# Altium project LM-003.PrjPcb
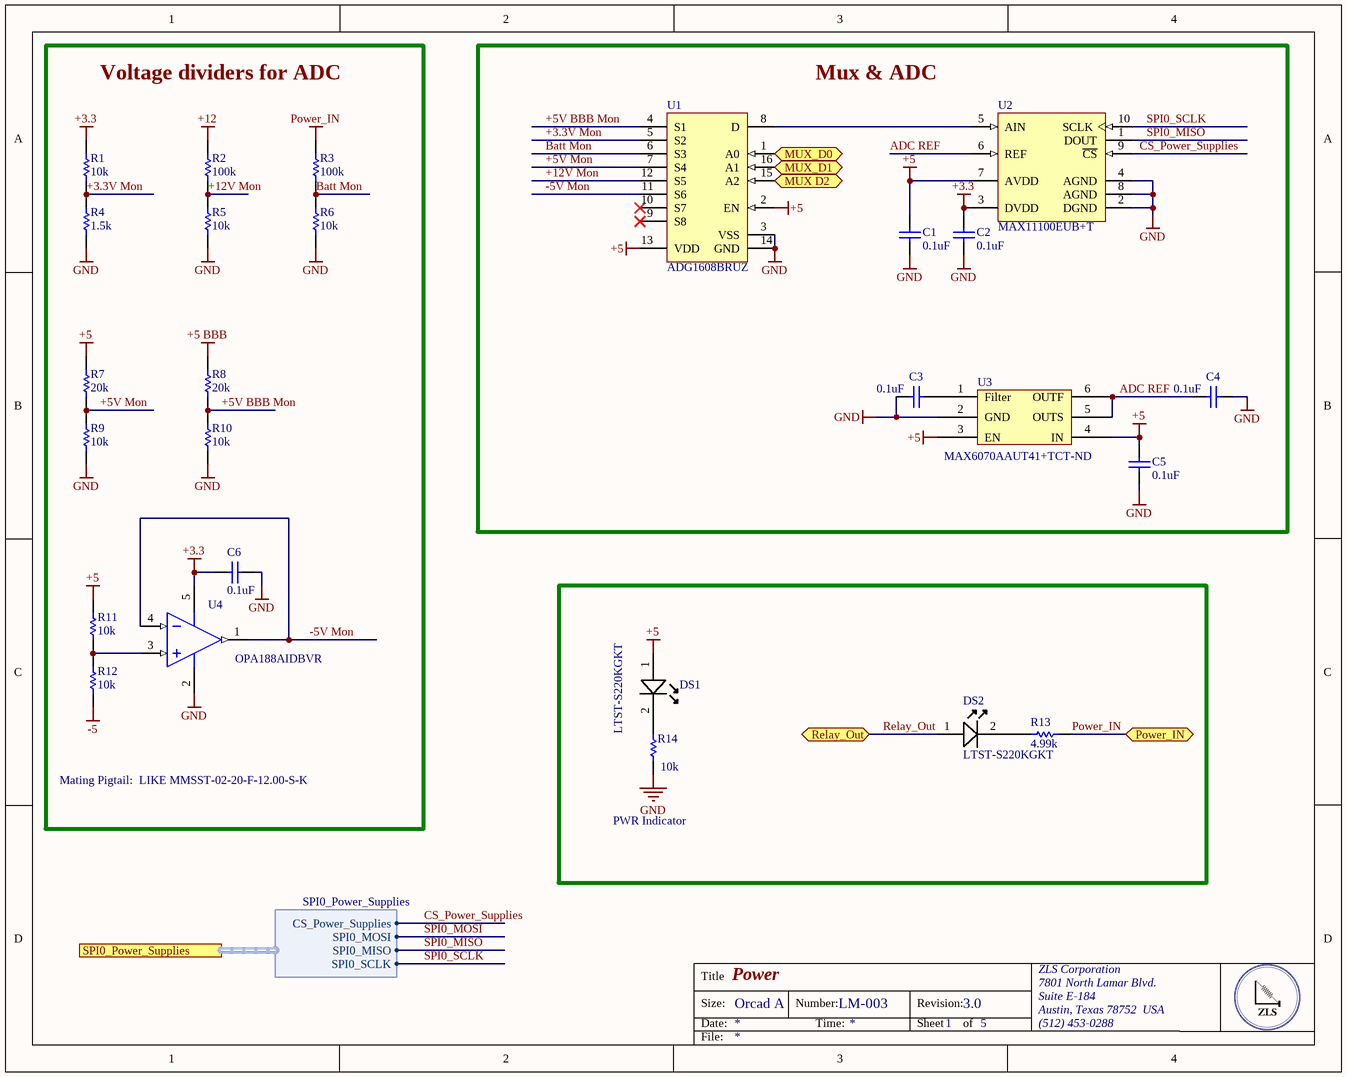
[diagram p0: Power.SchDoc]
5 sheets, 66 parts. Net scope: flat (ports and power ports of the same name join across sheets).
Board file: LM-003.PcbDoc
Sheets:
  Power.SchDoc
  BBB Headers.SchDoc
  Connectors.SchDoc
  RS232.SchDoc
  heater_control.SchDoc

## Sheet Power.SchDoc: Power
size OrCAD A; DocumentNumber: LM-003; Revision: 3.0; SheetNumber: 1; SheetTotal: 5

### Parts
(Parts that share a designator on the sheet are numbered #1, #2 ... from top to bottom, then left to right.)
C1  0.1uF  [CAPC0402(1005)60_L]
C2  0.1uF  [CAPC0402(1005)60_L]
C3  0.1uF  [CAPC0402(1005)60_L]
C4  0.1uF  [CAPC0402(1005)60_L]
C5  0.1uF  [CAPC0402(1005)60_L]
C6  0.1uF  [CAPC0402(1005)60_L]
DS1  Manufacturer Part Number: LTST-S220KGKT  [0805C_L]  (hidden comment: Lite-On LTST-S220KGKT Green LED, 571 nm 2012 (0805) Side View, Rectangle Lens SMD package)
DS2  Manufacturer Part Number: LTST-S220KGKT  [0805C_L]  (hidden comment: Lite-On LTST-S220KGKT Green LED, 571 nm 2012 (0805) Side View, Rectangle Lens SMD package)
R1  10k  [RESC0402(1005)_M]
R2  100k  [RESC0402(1005)_M]
R3  100k  [RESC0402(1005)_M]
R4  1.5k  [RESC0402(1005)_M]
R5  10k  [RESC0402(1005)_M]
R6  10k  [RESC0402(1005)_M]
R7  20k  [RESC0402(1005)_M]
R8  20k  [RESC0402(1005)_M]
R9  10k  [RESC0402(1005)_M]
R10  10k  [RESC0402(1005)_M]
R11  10k  [RESC0402(1005)_M]
R12#1  10k  [RESC0402(1005)_M]
R13  4.99k  [RESC0402(1005)_M]
R14  10k  [RESC0402(1005)_M]
U1  ADG1608BRUZ  [ADI-RU-16_M]
U2  MAX11100EUB+T  [U10+2_L]
U3  Supplier Part Number 1: MAX6070AAUT41+TCT-ND  [SOT95P280X445-6N]  (hidden comment: MAX6070AAUT41+T)
U4  OPA188AIDBVR  [DBV0005A_M]

### Blocks framed on the sheet
Voltage dividers for ADC: C6 R1-R11 R12#1 U4
Mux & ADC: C1-C5 U1-U3
PWR Indicator: DS1 DS2 R13 R14

### Ports
MUX D2, MUX_D0, MUX_D1, Power_IN, Relay_Out, SPI0_Power_Supplies (harness SPI0_Power_Supplies)

### Harnesses
SPI0_Power_Supplies: CS_Power_Supplies, SPI0_MOSI, SPI0_MISO, SPI0_SCLK

### Nets
+3.3: C2.1 C6.1 R1.2 U2.3(DVDD) U4.5(V+)
+5: C1.1 C5.1 DS1.1(A) R7.2 R11.2 U1.2(EN) U1.13(VDD) U2.7(AVDD) U3.3(EN) U3.4(IN)
+5 BBB: R8.2
+12: R2.2
-5: R12#1.1
GND: C1.2 C2.2 C3.2 C4.1 C5.2 C6.2 R4.1 R5.1 R6.1 R9.1 R10.1 R14.2 U1.3(VSS) U1.14(GND) U2.2(DGND) U2.4(AGND) U2.8(AGND) U3.2(GND) U4.2(V-)
Power_IN: R3.2 R13.2 ; port Power_IN
+3.3V Mon: R1.1 R4.2 U1.5(S2)
+5V BBB Mon: R8.1 R10.2 U1.4(S1)
+5V Mon: R7.1 R9.2 U1.7(S4)
+12V Mon: R2.1 R5.2 U1.12(S5)
-5V Mon: U1.11(S6) U4.1(OUT) U4.4(IN-)
ADC REF: C4.2 U2.6(REF) U3.5(OUTS) U3.6(OUTF)
Batt Mon: R3.1 R6.2 U1.6(S3)
CS_Power_Supplies: U2.9(~{CS}) ; port SPI0_Power_Supplies.CS_Power_Supplies
MUX D2: U1.15(A2) ; port MUX D2
MUX_D0: U1.1(A0) ; port MUX_D0
MUX_D1: U1.16(A1) ; port MUX_D1
Relay_Out: DS2.1(A) ; port Relay_Out
SPI0_MISO: U2.1(DOUT) ; port SPI0_Power_Supplies.SPI0_MISO
SPI0_SCLK: U2.10(SCLK) ; port SPI0_Power_Supplies.SPI0_SCLK
NetC3_1: C3.1 U3.1(Filter)
NetDS1_2: DS1.2(K) R14.1
NetDS2_2: DS2.2(K) R13.1
NetR11_1: R11.1 R12#1.2 U4.3(IN+)
NetU1_8: U1.8(D) U2.5(AIN)

Not connected (* = marked no-connect by the designer): U1 9(S8)* 10(S7)*

### Notes on the sheet
- Mating Pigtail:  LIKE MMSST-02-20-F-12.00-S-K
- Title
- Size:
- Date:
- Orcad A
- Number:
- Time:
- Revision:
- Sheet
- of
- ZLS Corporation
- 7801 North Lamar Blvd.
- Suite E-184
- Austin, Texas 78752  USA
- (512) 453-0288
- File:

### Library data of the parts
C1-C6 = CMP-1034-00252-1: CAP CER 0.1UF 10V X7R 0402; Manufacturer: Murata Electronics North America; Manufacturer Part Number: GRM155R71A104KA01D; Tolerance: ±10%; Supplier 1: Digi-Key; Supplier Part Number 1: 490-6321-1-ND; RoHS: RoHS Compliant; Category: Capacitors; Stock 1: 2920395; Pricing 1: 1=0.1, 10=0.014, 100=0.0063, 500=0.00446, 1000=0.00351, 2500=0.00319, 5000=0.00293 (USD); Packaging: Cut Tape (CT); Part Status: Active; Voltage - Rated: 10V; Temperature Coefficient: X7R; Operating Temperature: -55°C ~ 125°C; Features: -; Ratings: -; Applications: General Purpose; Mounting Type: Surface Mount, MLCC; Package / Case: 0402 (1005 Metric); Size / Dimension: 0.039" L x 0.020" W (1.00mm x 0.50mm); Height - Seated (Max): -; Thickness (Max): 0.022" (0.55mm); Lead Spacing: -; ComponentLink1URL: http://www.murata.com/~/media/webrenewal/support/library/catalog/products/capacitor/mlcc/c02e.ashx?la=en-us; ComponentLink1Description: http://www.murata.com/~/media/webrenewal/support/library/catalog/products/capacitor/mlcc/c02e.ashx?la=en-us
DS1 DS2 = LED A/K: Manufacturer: Vishay / Lite-On; Lens Colour: Colorless; Viewing Angle: 130°; Luminous Intensity: 35mcd; Forward Current: 20mA; Forward Voltage: 2V; Lens Style: Diffused,Colorless; Power Rating: 75mW; Dominant Wavelength: 568nm; Lens Transparency: Clear; Number of Elements: 1; Power Dissipation: 75W; Wavelength: 574nm; Supplier 1: Digi-Key; Supplier Part Number 1: 160-1468-1-ND; Stock 1: 74800; Pricing 1: 1=0.29, 10=0.212, 25=0.1564, 100=0.1117, 250=0.0759, 500=0.067, 1000=0.0525 (USD); Mount: Surface Mount; Case/Package: 0805; Number of Pins: 2; Colour: Green; Case Code (Metric): 2012; Case Code (Imperial): 0805; Min Operating Temperature: -55°C; Max Operating Temperature: 85°C; Packaging: Tape and Reel; Package Quantity: 4000; Illumination Colour: Green; Test Current: 20mA; Number of LEDs: 1; Length: 2.1mm; Height: 0.6mm; Width: 1mm; Depth: 0.6mm; Radiation Hardening: No; Lead Free: Lead Free; ComponentLink1URL: https://datasheet.ciiva.com/11775/0900766b80dc0b70-11775441.pdf; ComponentLink1Description: https://datasheet.ciiva.com/11775/0900766b80dc0b70-11775441.pdf; ComponentLink2URL: https://datasheet.ciiva.com/2110/s-110-ltst-s220kgkt-2110069.pdf; ComponentLink2Description: https://datasheet.ciiva.com/2110/s-110-ltst-s220kgkt-2110069.pdf; ComponentLink3URL: https://datasheet.ciiva.com/2110/s-110-ltst-s220kgkt-2110070.pdf; ComponentLink3Description: https://datasheet.ciiva.com/2110/s-110-ltst-s220kgkt-2110070.pdf; ComponentLink4URL: https://datasheet.ciiva.com/12400/100-ltst-s220kgkt-59602-12400886.pdf; ComponentLink4Description: https://datasheet.ciiva.com/12400/100-ltst-s220kgkt-59602-12400886.pdf; ComponentLink5URL: https://datasheet.ciiva.com/2110/s-110-ltst-s220kgkt-2110071.pdf; ComponentLink5Description: https://datasheet.ciiva.com/2110/s-110-ltst-s220kgkt-2110071.pdf; ComponentLink6URL: https://datasheet.ciiva.com/16379/ltst-s220kgkt-16379082.pdf; ComponentLink6Description: https://datasheet.ciiva.com/16379/ltst-s220kgkt-16379082.pdf
  DS2: Supplier 2: Farnell; Supplier Part Number 2: 2062310; RoHS: YES; Stock 2: 2271; Pricing 2: 1=0.325, 10=0.317, 100=0.23, 200=0.228, 400=0.182, 900=0.147, 3000=0.114, 9000=0.107 (GBP); ComponentLink7URL: http://www.farnell.com/cad/2124774.pdf; ComponentLink7Description: http://www.farnell.com/cad/2124774.pdf; ComponentLink8URL: http://www.farnell.com/datasheets/693084.pdf; ComponentLink8Description: http://www.farnell.com/datasheets/693084.pdf
R1-R11 R12#1 R13 R14 = CMP-1011-00651-1
U1 = CMP-0793-00136-1: 4.5 Ohm Ron, 8-Channel +/-5 V,+12 V, +5 V and +3.3 V Multiplexer, 16-pin SOP (RU-16), Tube; Manufacturer: Analog Devices; Max Analog Signal Range: 0 to Vdd; Ron (ohms): 4.4; t transition (s): 150n; Bandwidth (Hz): 40M, 40M, 37M, 34M; Code_JEDEC: MO-153AB; PackageReference: RU-16; PackageDescription: 16-Pin Thin Shrink Small Outline Package, Body 5 x 4.4 mm, Pitch 0.65 mm; ComponentLink1Description: Manufacturer URL; ComponentLink2Description: Datasheet; PartNumber: ADG1608BRUZ; Mounting Technology: Surface Mount; PackageVersion: Nov-02; ComponentLink3Description: Package Specification; DatasheetVersion: Rev. 0; Packing: Tube; ComponentLink1URL: http://www.analog.com/en/index.html; ComponentLink3URL: http:/www.analog.com/static/imported-files/packages/36244347913743854010197452789RU16.pdf; ComponentLink2URL: http://www.analog.com/static/imported-files/data_sheets/ADG1608_1609.pdf
U2 = CMP-0249-00017-1: 16-Bit, +5V, 200ksps ADC with 10uA Shutdown, 10-Pin uMAX, -40°C to +85°C, Pb-Free, Tape and Reel; DatasheetVersion: Rev 1, Jan-2012; ComponentLink3URL: http://pdfserv.maxim-ic.com/package_dwgs/21-0061.PDF; PackageReference: U10+2; ComponentLink2URL: http://datasheets.maxim-ic.com/en/ds/MAX11100.pdf; PackageVersion: revL, 2008; ComponentLink1Description: Manufacturer URL; Code_JEDEC: MO-187-BA; ComponentLink1URL: http://www.maxim-ic.com; ComponentLink3Description: Package Specification; PackageDescription: 10-Pin Micro-MAX Thin Shrink Small Outline (uSOP), 3 x 3 x 0.85 mm Body, 0.5 mm Pitch, Pb-Free; ComponentLink2Description: Datasheet
U3 = MAX6070AAUT41+T: IC VREF SERIES 4.096V SOT23; Manufacturer: Maxim Integrated; Output Type: Fixed; Tolerance: ±0.04%; Temperature Coefficient: 6ppm/°C; Noise - 0.1Hz to 10Hz: 9.6µVp-p; Noise - 10Hz to 10kHz: 9µVrms; Voltage - Input: 4.3 V ~ 5.5 V; Current - Supply: 350µA; Supplier 1: Digi-Key; Manufacturer Part Number: MAX6070AAUT41+T; RoHS: RoHS Compliant; Category: Integrated Circuits (ICs); Stock 1: 2623; Pricing 1: 1=3.41, 10=3.213, 25=2.5704, 50=2.4418, 100=2.2491, 250=2.13344, 500=2.05634 (USD); Packaging: Cut Tape (CT); Part Status: Active; Reference Type: Series; Voltage - Output (Min/Fixed): 4.096V; Operating Temperature: -40°C ~ 125°C (TA); Mounting Type: Surface Mount; Package / Case: SOT-23-6; Supplier Device Package: SOT-23-6; ComponentLink1URL: https://datasheets.maximintegrated.com/en/ds/MAX6070-MAX6071.pdf; ComponentLink1Description: https://datasheets.maximintegrated.com/en/ds/MAX6070-MAX6071.pdf
U4 = CMP-0809-00005-2: Precision, Low Noise, Rail-to-Rail Output, Zero-Drift Operational Amplifier, 4 to 36 V, -40 to 125 degC, 5-pin SOT23 (DBV5), Green (RoHS & no Sb/Br); Manufacturer: Texas Instruments; Total Supply Voltage(Min)(+5V is 5, +/-5V is 10): 4; Offset Drift(Typ)(uV/C): 0.03; Rating: Catalog; SubFamily: Zero Drift Precision Amplifier; GBW(Typ)(MHz): 2; Slew Rate(Typ)(V/us): 0.8; Number of Channels: 1; CMRR(Min)(dB): 120; Iq per channel(Max)(mA): 0.51; Total Supply Voltage(Max)(+5V is 5, +/-5V is 10): 36; PartNumber: OPA188AIDBVR; ComponentLink2Description: Datasheet; ComponentLink2URL: http://www.ti.com/lit/ds/symlink/opa188.pdf; ComponentLink1Description: Manufacturer URL; Mounting Technology: Surface Mount; Eco-Plan: Green (RoHS & no Sb/Br); ComponentLink1URL: http://www.ti.com/; PackageVersion: 4073253-4/K, 03/2006; DatasheetVersion: SBOS642A; ComponentLink3Description: Package Specification; PackageReference: DBV0005A; ComponentLink3URL: http://www.ti.com/litv/pdf/mpds018i; PackageDescription: 5-Pin Plastic Small Outline, Body 1.6 x 2.9 mm, Pitch 0.95 mm; Code_JEDEC: MO-178

## Sheet BBB Headers.SchDoc: BBB Headers
size Tabloid; DocumentNumber: LM-003; Revision: 3.0; SheetNumber: 2; SheetTotal: 5
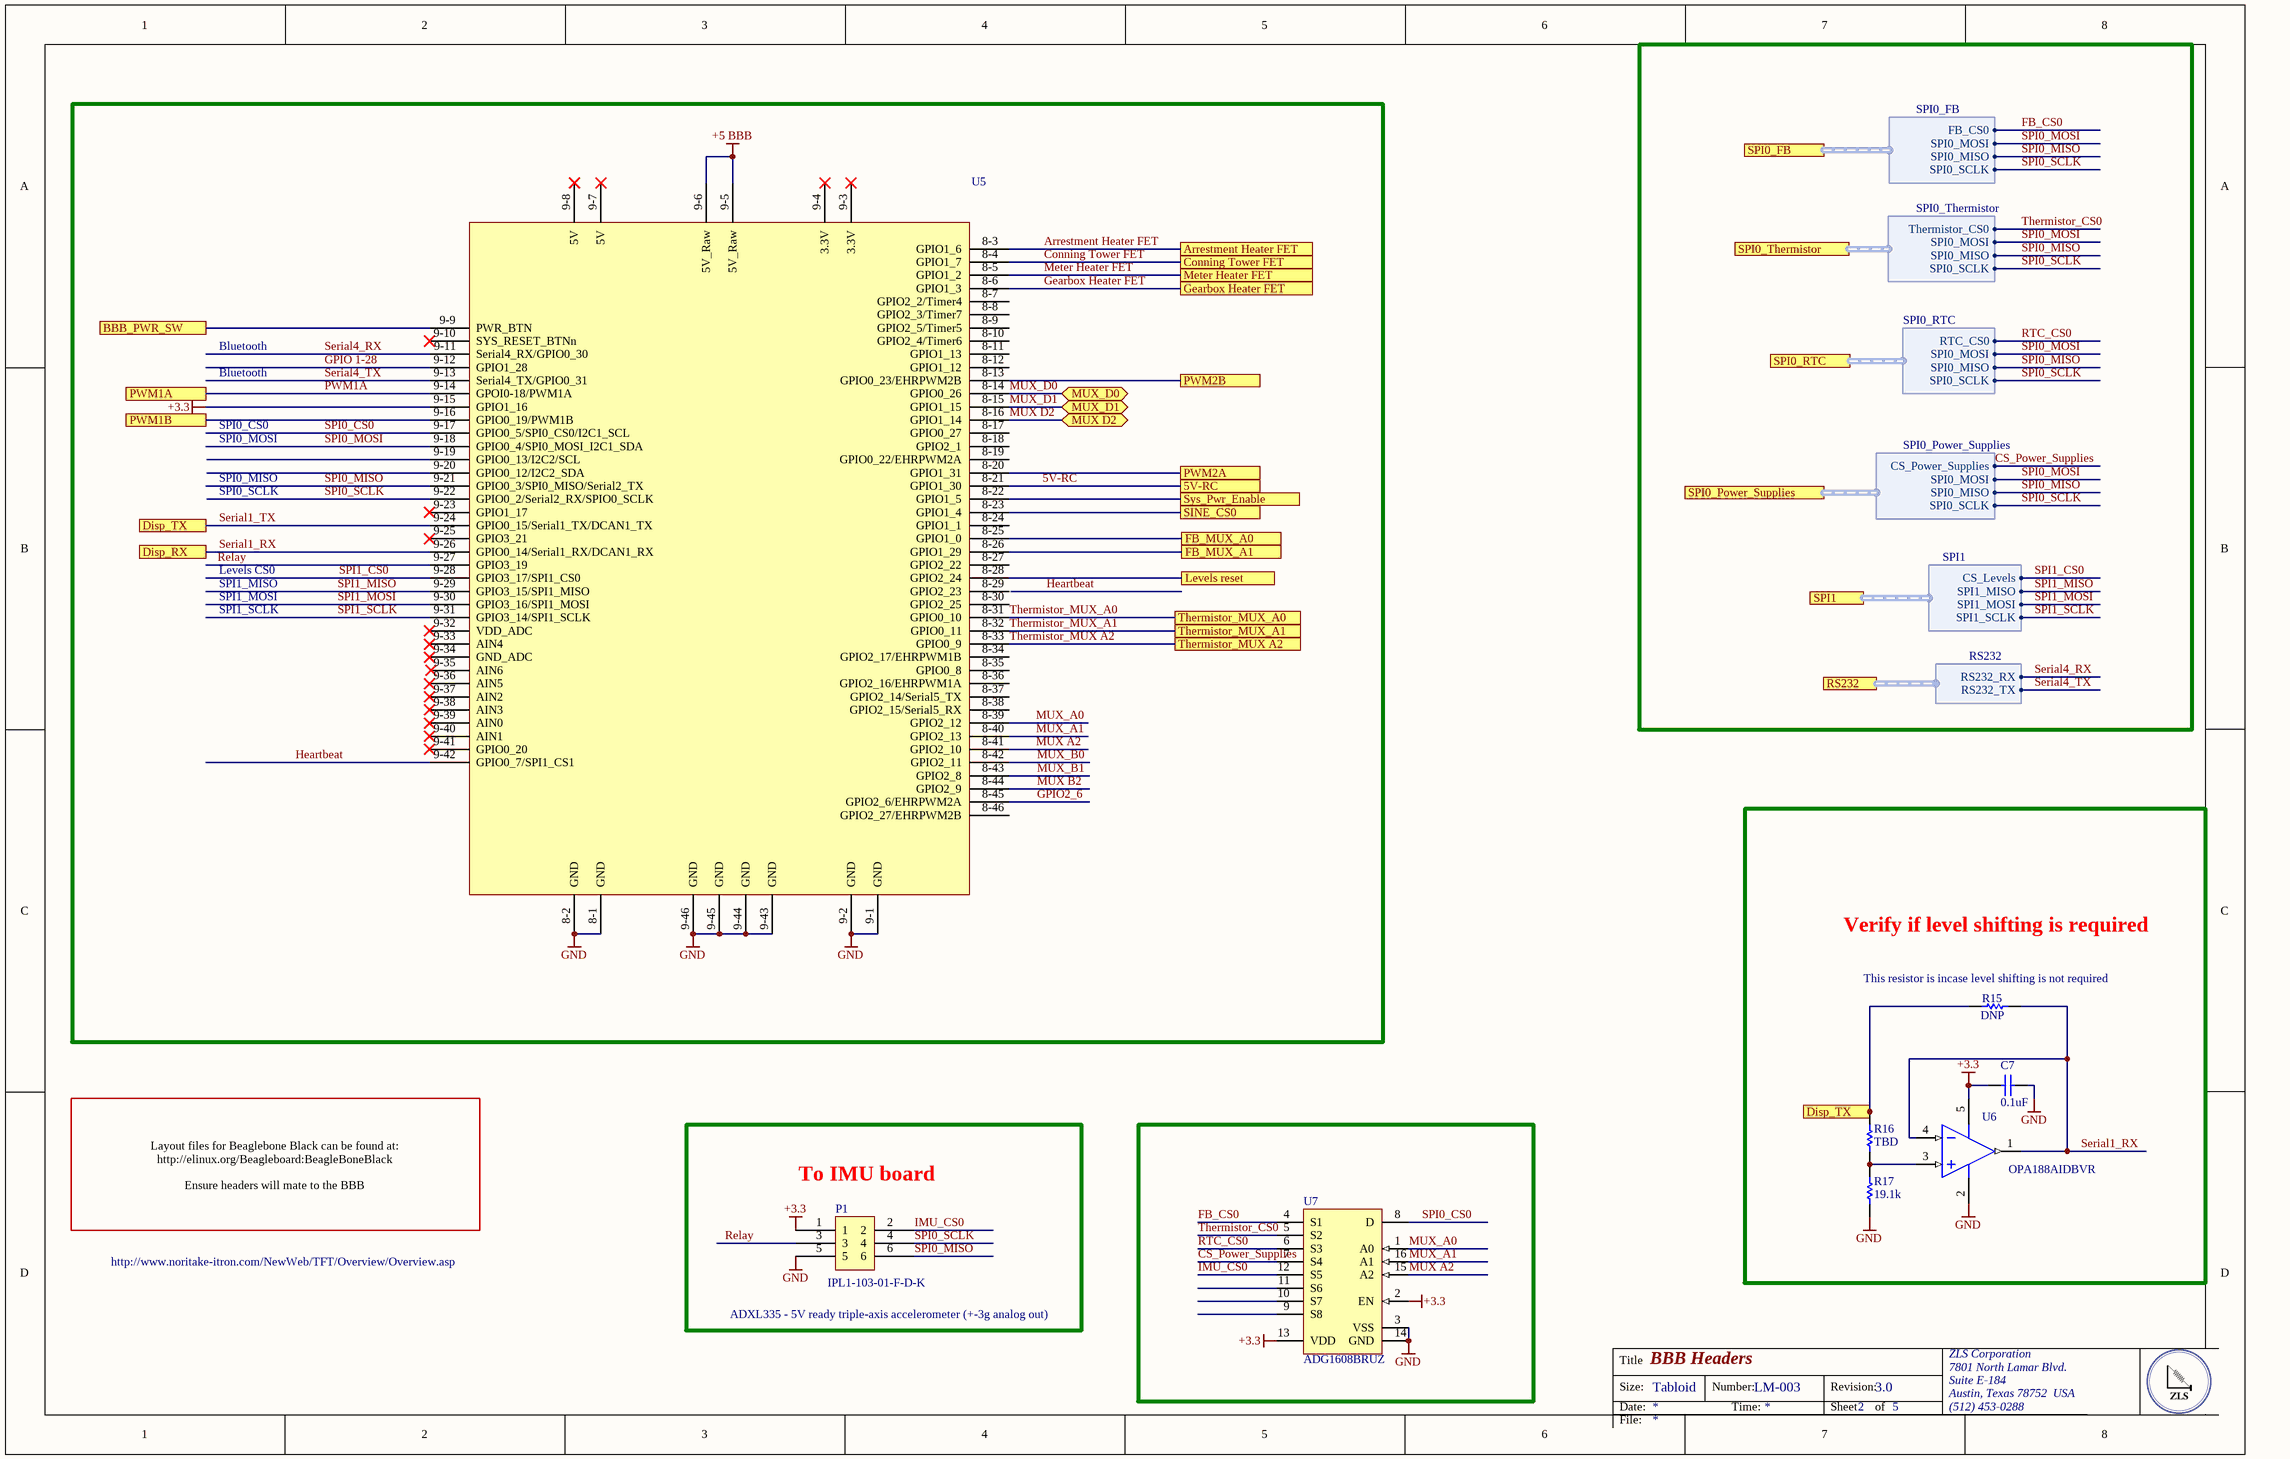
[diagram p1: BBB Headers.SchDoc]

### Parts
(Parts that share a designator on the sheet are numbered #1, #2 ... from top to bottom, then left to right.)
C7  0.1uF  [CAPC0402(1005)60_L]
P1  Manufacturer Part Number: IPL1-103-01-F-D-K  [IPL1-103-01-F-D]  (hidden comment: IPL1-103-01-F-D)
R15  DNP  [RESC0402(1005)_M]
R16  TBD  [RESC0402(1005)_M]
R17#1  19.1k  [RESC0402(1005)_M]
U5#1  BBB  [Beaglebone Black]  (value not drawn)
U6  OPA188AIDBVR  [DBV0005A_M]
U7  ADG1608BRUZ  [ADI-RU-16_M]

### Blocks framed on the sheet
Verify if level shifting is required: C7 R15 R16 R17#1 U6
To IMU board: P1

### Ports
5V-RC, Arrestment Heater FET, BBB_PWR_SW, Conning Tower FET, Disp_RX, Disp_TX, FB_MUX_A0, FB_MUX_A1, Gearbox Heater FET, Levels reset, Meter Heater FET, MUX D2, MUX_D0, MUX_D1, PWM1A, PWM1B, PWM2A, PWM2B, RS232 (harness RS232), SINE_CS0, SPI0_FB (harness SPI0_FB), SPI0_Power_Supplies (harness SPI0_Power_Supplies), SPI0_RTC (harness SPI0_RTC), SPI0_Thermistor (harness SPI0_Thermistor), SPI1 (harness SPI1), Sys_Pwr_Enable, Thermistor_MUX A2, Thermistor_MUX_A0, Thermistor_MUX_A1

### Harnesses
RS232: RS232_RX, RS232_TX
SPI1: CS_Levels, SPI1_MISO, SPI1_MOSI, SPI1_SCLK
SPI0_RTC: RTC_CS0, SPI0_MOSI, SPI0_MISO, SPI0_SCLK
SPI0_Power_Supplies: CS_Power_Supplies, SPI0_MOSI, SPI0_MISO, SPI0_SCLK
SPI0_Thermistor: Thermistor_CS0, SPI0_MOSI, SPI0_MISO, SPI0_SCLK
SPI0_FB: FB_CS0, SPI0_MOSI, SPI0_MISO, SPI0_SCLK

### Nets
+3.3: C7.1 P1.1 U5#1.9-15(GPIO1_16) U6.5(V+) U7.2(EN) U7.13(VDD)
+5 BBB: U5#1.9-5(5V_Raw) U5#1.9-6(5V_Raw)
GND: C7.2 P1.5 R17#1.1 U5#1.8-1(GND) U5#1.8-2(GND) U5#1.9-1(GND) U5#1.9-2(GND) U5#1.9-43(GND) U5#1.9-44(GND) U5#1.9-45(GND) U5#1.9-46(GND) U6.2(V-) U7.3(VSS) U7.14(GND)
5V-RC: U5#1.8-21(GPIO1_30) ; port 5V-RC
Arrestment Heater FET: U5#1.8-3(GPIO1_6) ; port Arrestment Heater FET
Conning Tower FET: U5#1.8-4(GPIO1_7) ; port Conning Tower FET
CS_Power_Supplies: U7.7(S4) ; port SPI0_Power_Supplies.CS_Power_Supplies
FB_CS0: U7.4(S1) ; port SPI0_FB.FB_CS0
FB_MUX_A0: U5#1.8-25(GPIO1_0) ; port FB_MUX_A0
FB_MUX_A1: U5#1.8-26(GPIO1_29) ; port FB_MUX_A1
Gearbox Heater FET: U5#1.8-6(GPIO1_3) ; port Gearbox Heater FET
GPIO2_6: U5#1.8-45(GPIO2_6/EHRPWM2A)
GPIO 1-28: U5#1.9-12(GPIO1_28)
Heartbeat: U5#1.9-42(GPIO0_7/SPI1_CS1)
IMU_CS0: P1.2 U7.12(S5)
Meter Heater FET: U5#1.8-5(GPIO1_2) ; port Meter Heater FET
MUX A2: U5#1.8-41(GPIO2_10) U7.15(A2)
MUX B2: U5#1.8-44(GPIO2_9)
MUX D2: U5#1.8-16(GPIO1_14) ; port MUX D2
MUX_A0: U5#1.8-39(GPIO2_12) U7.1(A0)
MUX_A1: U5#1.8-40(GPIO2_13) U7.16(A1)
MUX_B0: U5#1.8-42(GPIO2_11)
MUX_B1: U5#1.8-43(GPIO2_8)
MUX_D0: U5#1.8-14(GPIO0_26) ; port MUX_D0
MUX_D1: U5#1.8-15(GPIO1_15) ; port MUX_D1
PWM1A: U5#1.9-14(GPOI0-18/PWM1A) ; port PWM1A
PWM2B: U5#1.8-13(GPIO0_23/EHRPWM2B) ; port PWM2B
Relay: P1.3 U5#1.9-27(GPIO3_19)
RTC_CS0: U7.6(S3) ; port SPI0_RTC.RTC_CS0
Serial1_RX: R15.2 U5#1.9-26(GPIO0_14/Serial1_RX/DCAN1_RX) U6.1(OUT) U6.4(IN-) ; port Disp_RX
Serial1_TX: R15.1 R16.2 U5#1.9-24(GPIO0_15/Serial1_TX/DCAN1_TX) ; port Disp_TX
Serial4_RX: U5#1.9-11(Serial4_RX/GPIO0_30) ; port RS232.RS232_RX
Serial4_TX: U5#1.9-13(Serial4_TX/GPIO0_31) ; port RS232.RS232_TX
SPI0_CS0: U5#1.9-17(GPIO0_5/SPI0_CS0/I2C1_SCL) U7.8(D)
SPI0_MISO: P1.6 U5#1.9-21(GPIO0_3/SPI0_MISO/Serial2_TX) ; port SPI0_RTC.SPI0_MISO, port SPI0_Power_Supplies.SPI0_MISO, port SPI0_Thermistor.SPI0_MISO, port SPI0_FB.SPI0_MISO
SPI0_MOSI: U5#1.9-18(GPIO0_4/SPI0_MOSI_I2C1_SDA) ; port SPI0_RTC.SPI0_MOSI, port SPI0_Power_Supplies.SPI0_MOSI, port SPI0_Thermistor.SPI0_MOSI, port SPI0_FB.SPI0_MOSI
SPI0_SCLK: P1.4 U5#1.9-22(GPIO0_2/Serial2_RX/SPIO0_SCLK) ; port SPI0_RTC.SPI0_SCLK, port SPI0_Power_Supplies.SPI0_SCLK, port SPI0_Thermistor.SPI0_SCLK, port SPI0_FB.SPI0_SCLK
SPI1_CS0: U5#1.9-28(GPIO3_17/SPI1_CS0) ; port SPI1.CS_Levels
SPI1_MISO: U5#1.9-29(GPIO3_15/SPI1_MISO) ; port SPI1.SPI1_MISO
SPI1_MOSI: U5#1.9-30(GPIO3_16/SPI1_MOSI) ; port SPI1.SPI1_MOSI
SPI1_SCLK: U5#1.9-31(GPIO3_14/SPI1_SCLK) ; port SPI1.SPI1_SCLK
Sys_Pwr_Enable: U5#1.8-22(GPIO1_5) ; port Sys_Pwr_Enable
Thermistor_CS0: U7.5(S2) ; port SPI0_Thermistor.Thermistor_CS0
Thermistor_MUX A2: U5#1.8-33(GPIO0_9) ; port Thermistor_MUX A2
Thermistor_MUX_A0: U5#1.8-31(GPIO0_10) ; port Thermistor_MUX_A0
Thermistor_MUX_A1: U5#1.8-32(GPIO0_11) ; port Thermistor_MUX_A1
NetP7_4: U5#1.8-23(GPIO1_4) ; port SINE_CS0
NetP8_4: U5#1.9-9(PWR_BTN) ; port BBB_PWR_SW
NetR16_1: R16.1 R17#1.2 U6.3(IN+)
NetU5#1_8-20: U5#1.8-20(GPIO1_31) ; port PWM2A
NetU5#1_8-28: U5#1.8-28(GPIO2_24) ; port Levels reset
NetU5#1_9-16: U5#1.9-16(GPIO0_19/PWM1B) ; port PWM1B

Not connected (* = marked no-connect by the designer): U5#1 8-7(GPIO2_2/Timer4) 8-8(GPIO2_3/Timer7) 8-9(GPIO2_5/Timer5) 8-10(GPIO2_4/Timer6) 8-11(GPIO1_13) 8-12(GPIO1_12) 8-17(GPIO0_27) 8-18(GPIO2_1) 8-19(GPIO0_22/EHRPWM2A) 8-24(GPIO1_1) 8-27(GPIO2_22) 8-29(GPIO2_23) 8-30(GPIO2_25) 8-34(GPIO2_17/EHRPWM1B) 8-35(GPIO0_8) 8-36(GPIO2_16/EHRPWM1A) 8-37(GPIO2_14/Serial5_TX) 8-38(GPIO2_15/Serial5_RX) 8-46(GPIO2_27/EHRPWM2B) 9-3(3.3V)* 9-4(3.3V)* 9-7(5V)* 9-8(5V)* 9-10(SYS_RESET_BTNn)* 9-19(GPIO0_13/I2C2/SCL) 9-20(GPIO0_12/I2C2_SDA) 9-23(GPIO1_17)* 9-25(GPIO3_21)* 9-32(VDD_ADC)* 9-33(AIN4)* 9-34(GND_ADC)* 9-35(AIN6) 9-36(AIN5)* 9-37(AIN2)* 9-38(AIN3)* 9-39(AIN0)* 9-40(AIN1)* 9-41(GPIO0_20)*; U7 9(S8) 10(S7) 11(S6)

### Notes on the sheet
- Bluetooth
- SPI0_CS0
- SPI0_MISO
- SPI0_MOSI
- SPI0_SCLK
- SPI1_MISO
- SPI1_SCLK
- Levels CS0
- SPI1_MOSI
- (near R15) This resistor is incase level shifting is not required
- Layout files for Beaglebone Black can be found at:
  http://elinux.org/Beagleboard:BeagleBoneBlack
  Ensure headers will mate to the BBB
- http://www.noritake-itron.com/NewWeb/TFT/Overview/Overview.asp
- ADXL335 - 5V ready triple-axis accelerometer (+-3g analog out)
- Title
- Size:
- Date:
- Tabloid
- Number:
- Time:
- Revision:
- Sheet
- of
- ZLS Corporation
- 7801 North Lamar Blvd.
- Suite E-184
- Austin, Texas 78752  USA
- (512) 453-0288
- File:

### Library data of the parts
C7 = CMP-1034-00252-1: as C1 on sheet Power; Supplier 1: Digi-Key; Supplier Part Number 1: 490-6321-1-ND; RoHS: RoHS Compliant; Category: Capacitors; Stock 1: 2920395; Pricing 1: 1=0.1, 10=0.014, 100=0.0063, 500=0.00446, 1000=0.00351, 2500=0.00319, 5000=0.00293 (USD); Packaging: Cut Tape (CT); Part Status: Active; Voltage - Rated: 10V; Temperature Coefficient: X7R; Operating Temperature: -55°C ~ 125°C; Features: -; Ratings: -; Applications: General Purpose; Mounting Type: Surface Mount, MLCC; Package / Case: 0402 (1005 Metric); Size / Dimension: 0.039" L x 0.020" W (1.00mm x 0.50mm); Height - Seated (Max): -; Thickness (Max): 0.022" (0.55mm); Lead Spacing: -; ComponentLink1URL: http://www.murata.com/~/media/webrenewal/support/library/catalog/products/capacitor/mlcc/c02e.ashx?la=en-us; ComponentLink1Description: http://www.murata.com/~/media/webrenewal/support/library/catalog/products/capacitor/mlcc/c02e.ashx?la=en-us
P1 = IPL1-103-01-F-D: Manufacturer: SAMTEC; Supplier 1: Newark; Supplier Part Number 1: 51P2678; Stock 1: 0; Pricing 1: 1=1.8, 5000=1.56, 10000=1.46 (USD); ComponentLink1URL: https://webassistants.partcommunity.com/23d-libs/samtec/search/resolve.html?EMAIL=mysamtec@samtec.com&PN=HTSW-114-05-F-D; ComponentLink1Description: https://webassistants.partcommunity.com/23d-libs/samtec/search/resolve.html?EMAIL=mysamtec@samtec.com&PN=HTSW-114-05-F-D
R15 R16 R17#1 = CMP-1011-00651-1
U5#1 = Beaglebone_Black: Beaglebone Black; Manufacturer: Molex, LLC; Manufacturer Part Number: 0010897462; Connector Type: Header, Breakaway; Pitch - Mating: 0.100" (2.54mm); Style: Board to Board or Cable; Shrouding: Unshrouded; Number of Positions: 46; Number of Positions Loaded: All; Contact Length - Mating: 0.240" (6.10mm); Contact Length - Post: 0.107" (2.71mm); Overall Contact Length: 0.437" (11.10mm); Material Flammability Rating: UL94 V-0; Supplier 1: Digi-Key; Supplier Part Number 1: WM50012-46-ND; RoHS: RoHS Compliant; Category: Connectors, Interconnects; Stock 1: 407; Pricing 1: 1=7.65, 10=7.336, 25=6.698, 50=6.379, 100=6.0601, 250=5.4222, 500=5.10324 (USD); Packaging: Bulk; Part Status: Active; Contact Type: Male Pin; Number of Rows: 2; Row Spacing - Mating: 0.100" (2.54mm); Mounting Type: Through Hole; Termination: Solder; Fastening Type: -; Insulation Height: 0.090" (2.29mm); Contact Shape: Square; Contact Finish - Mating: Gold; Contact Finish Thickness - Mating: 15µin (0.38µm); Contact Finish - Post: Tin; Contact Material: Copper Alloy; Insulation Material: Liquid Crystal Polymer (LCP), Glass Filled; Features: -; Operating Temperature: -; Ingress Protection: -; Insulation Color: Black; Current Rating: -; Voltage Rating: -; Mated Stacking Heights: -; Contact Finish Thickness - Post: 74.8µin (1.90µm); Applications: Automotive, General Purpose, Lighting, Medical, Telecommunications; ComponentLink1URL: http://www.molex.com/pdm_docs/sd/010897041_sd.pdf; ComponentLink1Description: http://www.molex.com/pdm_docs/sd/010897041_sd.pdf
U6 = CMP-0809-00005-2: as U4 on sheet Power; PartNumber: OPA188AIDBVR; ComponentLink2Description: Datasheet; ComponentLink2URL: http://www.ti.com/lit/ds/symlink/opa188.pdf; ComponentLink1Description: Manufacturer URL; Mounting Technology: Surface Mount; Eco-Plan: Green (RoHS & no Sb/Br); ComponentLink1URL: http://www.ti.com/; PackageVersion: 4073253-4/K, 03/2006; DatasheetVersion: SBOS642A; ComponentLink3Description: Package Specification; PackageReference: DBV0005A; ComponentLink3URL: http://www.ti.com/litv/pdf/mpds018i; PackageDescription: 5-Pin Plastic Small Outline, Body 1.6 x 2.9 mm, Pitch 0.95 mm; Code_JEDEC: MO-178
U7 = CMP-0793-00136-1: as U1 on sheet Power; Code_JEDEC: MO-153AB; PackageReference: RU-16; PackageDescription: 16-Pin Thin Shrink Small Outline Package, Body 5 x 4.4 mm, Pitch 0.65 mm; ComponentLink1Description: Manufacturer URL; ComponentLink2Description: Datasheet; PartNumber: ADG1608BRUZ; Mounting Technology: Surface Mount; PackageVersion: Nov-02; ComponentLink3Description: Package Specification; DatasheetVersion: Rev. 0; Packing: Tube; ComponentLink1URL: http://www.analog.com/en/index.html; ComponentLink3URL: http:/www.analog.com/static/imported-files/packages/36244347913743854010197452789RU16.pdf; ComponentLink2URL: http://www.analog.com/static/imported-files/data_sheets/ADG1608_1609.pdf

## Sheet Connectors.SchDoc: Connectors
size OrCAD A; DocumentNumber: LM-003; Revision: 3.0; SheetNumber: 3; SheetTotal: 5
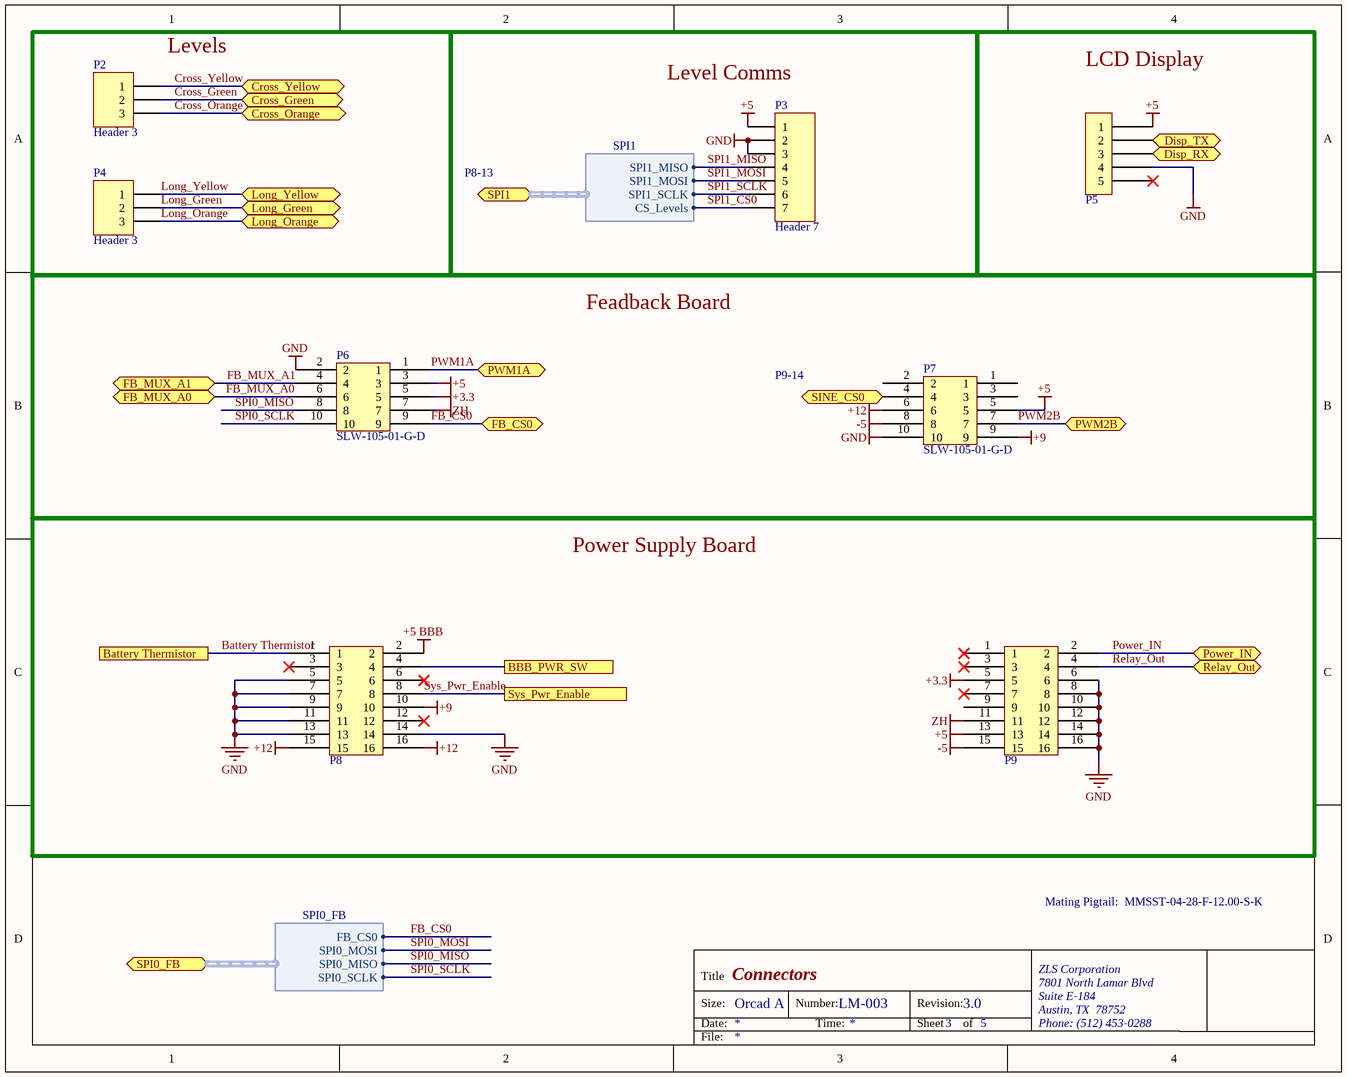
[diagram p2: Connectors.SchDoc]

### Parts
(Parts that share a designator on the sheet are numbered #1, #2 ... from top to bottom, then left to right.)
P2  Header 3  [HDR1X3]
P3  Header 7  [HDR1X7]
P4  Header 3  [HDR1X3]
P5  IPL1-105-01-F-S-K  [IPL1-105-01-F-S-K]  (value not drawn)
P6  SLW-105-01-G-D  [SLW-105-01-G-D]
P7  SLW-105-01-G-D  [SLW-105-01-G-D]
P8  SLW-108-01-G-D  [SLW-108-01-G-D]  (value not drawn)
P9#1  SLW-108-01-G-D  [SLW-108-01-G-D]  (value not drawn)

### Blocks framed on the sheet
Levels: P2 P4
Level Comms: P3
LCD Display: P5
Feadback Board: P6 P7
Power Supply Board: P8 P9#1

### Ports
Battery Thermistor, BBB_PWR_SW, Cross_Green, Cross_Orange, Cross_Yellow, Disp_RX, Disp_TX, FB_CS0, FB_MUX_A0, FB_MUX_A1, Long_Green, Long_Orange, Long_Yellow, Power_IN, PWM1A, PWM2B, Relay_Out, SINE_CS0, SPI0_FB (harness SPI0_FB), SPI1 (harness SPI1), Sys_Pwr_Enable

### Harnesses
SPI1: CS_Levels, SPI1_MISO, SPI1_MOSI, SPI1_SCLK
SPI0_FB: FB_CS0, SPI0_MOSI, SPI0_MISO, SPI0_SCLK

### Nets
+3.3: P6.5 P9#1.5
+5: P3.1 P5.1 P6.3 P7.5 P9#1.13
+5 BBB: P8.2
+9: P7.9 P8.10
+12: P7.6 P8.15 P8.16
-5: P7.8 P9#1.15
GND: P3.2 P3.3 P5.4 P6.2 P7.10 P8.5 P8.7 P8.9 P8.11 P8.13 P8.14 P9#1.6 P9#1.8 P9#1.10 P9#1.12 P9#1.14 P9#1.16
Power_IN: P9#1.2 ; port Power_IN
ZH: P6.7 P9#1.11
Battery Thermistor: P8.1 ; port Battery Thermistor
Cross_Green: P2.2 ; port Cross_Green
Cross_Orange: P2.3 ; port Cross_Orange
Cross_Yellow: P2.1 ; port Cross_Yellow
FB_CS0: P6.9 ; port FB_CS0, port SPI0_FB.FB_CS0
FB_MUX_A0: P6.6 ; port FB_MUX_A0
FB_MUX_A1: P6.4 ; port FB_MUX_A1
Long_Green: P4.2 ; port Long_Green
Long_Orange: P4.3 ; port Long_Orange
Long_Yellow: P4.1 ; port Long_Yellow
PWM1A: P6.1 ; port PWM1A
PWM2B: P7.7 ; port PWM2B
Relay_Out: P9#1.4 ; port Relay_Out
Serial1_RX: P5.3 ; port Disp_RX
Serial1_TX: P5.2 ; port Disp_TX
SPI0_MISO: P6.8 ; port SPI0_FB.SPI0_MISO
SPI0_SCLK: P6.10 ; port SPI0_FB.SPI0_SCLK
SPI1_CS0: P3.7 ; port SPI1.CS_Levels
SPI1_MISO: P3.4 ; port SPI1.SPI1_MISO
SPI1_MOSI: P3.5 ; port SPI1.SPI1_MOSI
SPI1_SCLK: P3.6 ; port SPI1.SPI1_SCLK
Sys_Pwr_Enable: P8.8 ; port Sys_Pwr_Enable
NetP7_4: P7.4 ; port SINE_CS0
NetP8_4: P8.4 ; port BBB_PWR_SW

Not connected (* = marked no-connect by the designer): P5 5*; P7 1 2 3; P8 3* 6* 12*; P9#1 1* 3* 7* 9

### Notes on the sheet
- P8-13
- P9-14
- Mating Pigtail:  MMSST-04-28-F-12.00-S-K
- Title
- Size:
- Date:
- Orcad A
- Number:
- Time:
- Revision:
- Sheet
- of
- ZLS Corporation
- 7801 North Lamar Blvd
- Suite E-184
- Austin, TX  78752
- Phone: (512) 453-0288
- File:

### Library data of the parts
P2 P4 = Header 3: Header, 3-Pin; LatestRevisionDate: 17-Jul-2002; LatestRevisionNote: Re-released for DXP Platform.; Publisher: Altium Limited
P3 = Header 7: Header, 7-Pin; LatestRevisionDate: 17-Jul-2002; LatestRevisionNote: Re-released for DXP Platform.; Publisher: Altium Limited
P6 P7 = SLW-105-01-G-D: CONN RCPT .100" 10POS DUAL GOLD; Manufacturer: Samtec Inc.; Connector Type: Receptacle; Style: Board to Board; Number of Positions: 10; Number of Positions Loaded: All; Pitch - Mating: 0.100" (2.54mm); Contact Length - Post: 0.115" (2.92mm); Mated Stacking Heights: 6.09mm; Supplier 1: Digi-Key; Supplier Part Number 1: SAM1088-05-ND; Manufacturer Part Number: SLW-105-01-G-D; RoHS: RoHS Compliant; Category: Connectors, Interconnects; Stock 1: 203; Pricing 1: 1=3.8, 10=3.401, 100=2.8012, 500=2.2143, 1000=1.90084, 5000=1.7341, 10000=1.6674 (USD); Packaging: Bulk; Part Status: Active; Contact Type: Forked; Row Spacing - Mating: 0.100" (2.54mm); Mounting Type: Through Hole; Termination: Solder; Fastening Type: Push-Pull; Contact Finish - Mating: Gold; Contact Finish Thickness - Mating: 20µin (0.51µm); Insulation Color: Black; Insulation Height: 0.180" (4.57mm); Operating Temperature: -55°C ~ 125°C; Material Flammability Rating: -; Contact Finish - Post: Gold; Ingress Protection: -; Features: -; Current Rating: -; Voltage Rating: -; Applications: -; Insulation Material: Polyester, Glass Filled; Contact Shape: Square; Contact Material: Phosphor Bronze; Contact Finish Thickness - Post: 3µin (0.08µm); ComponentLink1URL: http://suddendocs.samtec.com/prints/slw-1xx-01-x-x-mkt.pdf; ComponentLink1Description: http://suddendocs.samtec.com/prints/slw-1xx-01-x-x-mkt.pdf
P5 = IPL1-105-01-F-S-K: Supplier 1: Newark; Supplier Part Number 1: 99R3297
P8 P9#1 = SLW-108-01-G-D: Supplier 1: Digi-Key

## Sheet RS232.SchDoc: RS232
size OrCAD A; DocumentNumber: LM-003; Revision: 3.0; SheetNumber: 9; SheetTotal: 11
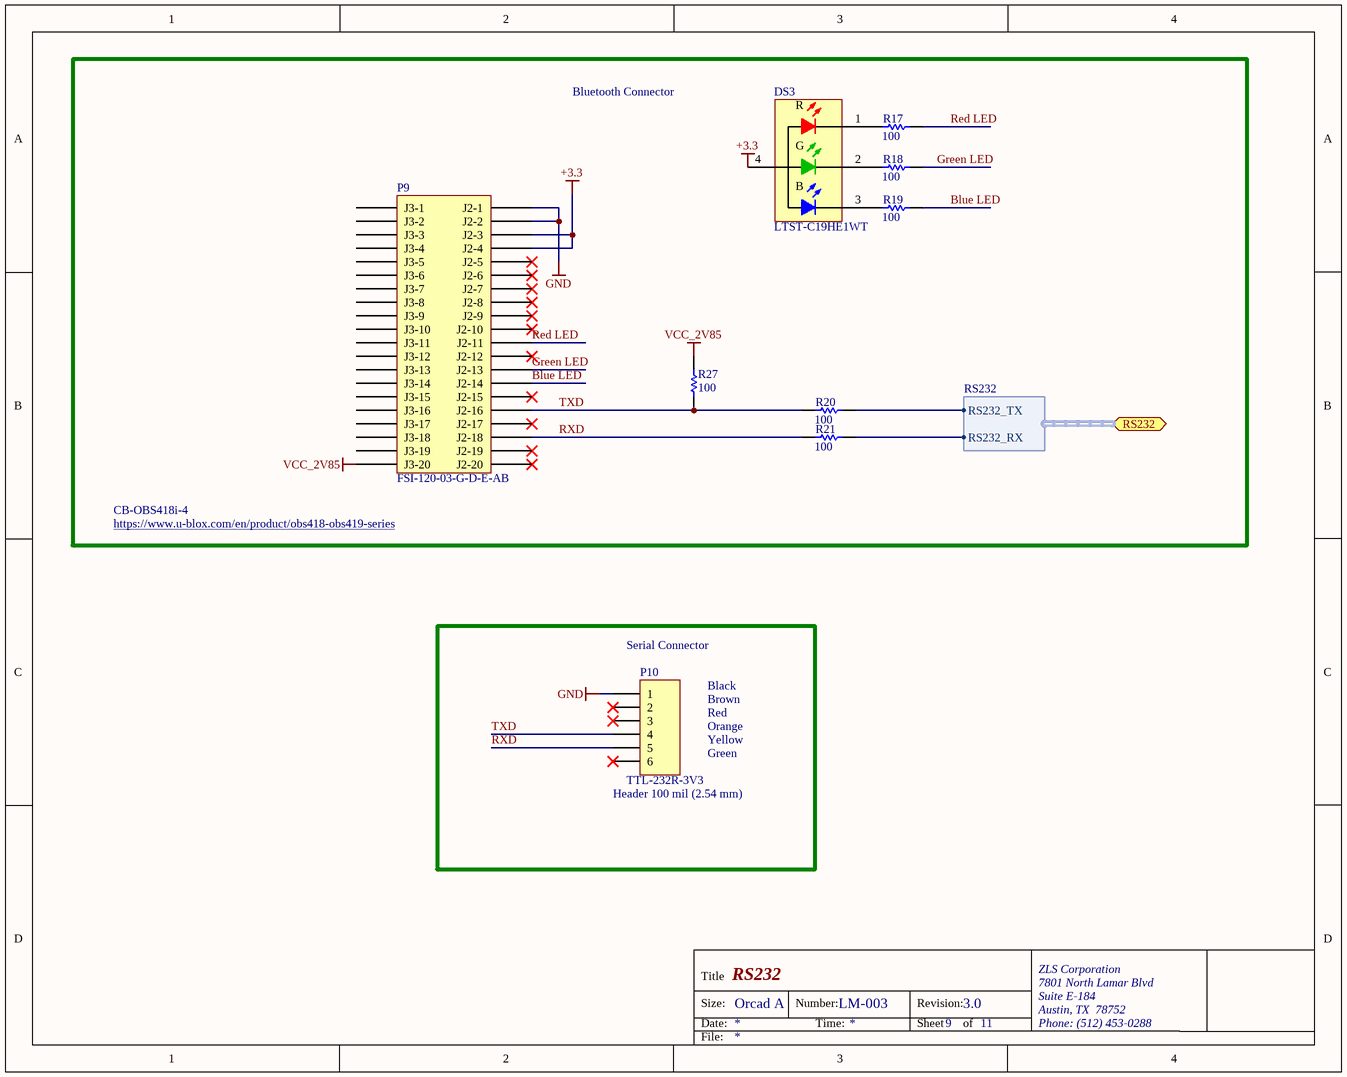
[diagram p3: RS232.SchDoc]

### Parts
(Parts that share a designator on the sheet are numbered #1, #2 ... from top to bottom, then left to right.)
DS3  LTST-C19HE1WT  [LTST-C19HE1WT-4_V]
P9#2  FSI-120-03-G-D-E-AB  [FSI-120-03-G-D-E-AB]
P10  Header 100 mil (2.54 mm)  [HDR1X6]
R17#2  100  [RESC0402(1005)_M]
R18  100  [RESC0402(1005)_M]
R19  100  [RESC0402(1005)_M]
R20  100  [RESC0402(1005)_M]
R21  100  [RESC0402(1005)_M]
R27  100  [RESC0402(1005)_M]

### Ports
RS232 (harness RS232)

### Harnesses
RS232: RS232_RX, RS232_TX

### Nets
+3.3: DS3.4(A) P9#2.J2-3 P9#2.J2-4
GND: P9#2.J2-1 P9#2.J2-2 P10.1
VCC_2V85: P9#2.J3-20 R27.2
Blue LED: P9#2.J2-14 R19.2
Green LED: P9#2.J2-13 R18.2
Red LED: P9#2.J2-11 R17#2.2
RXD: P9#2.J2-18 P10.5 R21.1
Serial4_RX: R21.2 ; port RS232.RS232_RX
Serial4_TX: R20.2 ; port RS232.RS232_TX
TXD: P9#2.J2-16 P10.4 R20.1 R27.1
NetDS3_1: DS3.1(R) R17#2.1
NetDS3_2: DS3.2(G) R18.1
NetDS3_3: DS3.3(B) R19.1

Not connected (* = marked no-connect by the designer): P9#2 J2-5* J2-6* J2-7* J2-8* J2-9* J2-10* J2-12* J2-15* J2-17* J2-19* J2-20* J3-1 J3-2 J3-3 J3-4 J3-5 J3-6 J3-7 J3-8 J3-9 J3-10 J3-11 J3-12 J3-13 J3-14 J3-15 J3-16 J3-17 J3-18 J3-19; P10 2* 3* 6*

### Notes on the sheet
- Bluetooth Connector
- CB-OBS418i-4
- https://www.u-blox.com/en/product/obs418-obs419-series
- (near P10) Serial Connector
- Black
- Brown
- Red
- Orange
- Yellow
- Green
- (near P10) TTL-232R-3V3
- Title
- Size:
- Date:
- Orcad A
- Number:
- Time:
- Revision:
- Sheet
- of
- ZLS Corporation
- 7801 North Lamar Blvd
- Suite E-184
- Austin, TX  78752
- Phone: (512) 453-0288
- File:

### Library data of the parts
DS3 = CMP-2000-05201-1: LED Tri-Color Blue/Green/Red, 5 V, -20 to 80 degC, 4-Pin SMD, RoHS, Tape and Reel; Manufacturer: Lite-On; Viewing Angle: 130deg; Forward Voltage: 2.4(Red)V,3.9(Blue)V,3.9(Green)V; Lens Shape: Rectangle; LED Material: AlInGaP(Red),InGaN(Blue),InGaN(Green); Dominant Wavelength: 470/525/624nm; Luminous Intensity: 180mcd,450mcd; Number of LEDs: 3; LED Colours: Blue,Green,Red; Lens Colour: Clear; Number of Pins: 3; Series: LTST; Mounting Type: SurfaceMount; Datasheet URL: http://download.siliconexpert.com/pdfs/2014/3/25/6/41/6/148/lot_/manual/s_110_ltst-c19he1wt.pdf; Manufacturer URL: http://www.us.liteon.com/; Datasheet Version: Rev. B, 10/2013; Dimensions: 1.6x1.6x0.35mm
P10 = Header 6H: CABLE USB SERIAL 3.3V 2MM HEADER; Manufacturer 1: FTDI, Future Technology Devices International Ltd; Manufacturer Part Number 1: TTL-232R-3V3-2MM; Category 1: Cable Assemblies; Usage: USB to TTL Serial 3.3V; Convert From (Adapter End): USB - A, Plug; Convert To (Adapter End): Rectangular Connector, Female Sockets, 8 pos (7 open), 2mm; Shielding: Unshielded; Supplier 1: Digi-Key; Supplier Part Number 1: 768-1095-ND; RoHS 1: RoHS Compliant; Description 1: CABLE USB SERIAL 3.3V 2MM HEADER; Stock 1: 274; Pricing 1: 1=20, 10=18, 50=16.875 (USD); Part Status: Active; Length: 5.90' (1.80m); ComponentLink1URL: http://www.ftdichip.com/Support/Documents/DataSheets/Cables/DS_TTL-232R_CABLES.pdf; ComponentLink1Description: http://www.ftdichip.com/Support/Documents/DataSheets/Cables/DS_TTL-232R_CABLES.pdf
R17#2 R18-R21 R27 = CMP-1011-00651-1
P9#2 = FSI-120-03-G-D-E-AB: Supplier 1: Avnet; Supplier Part Number 1: FSI-120-03-G-D-E-AB

## Sheet heater_control.SchDoc: Heater Control
size Tabloid; DocumentNumber: LM-003; Revision: 3.0; SheetNumber: 6; SheetTotal: 11
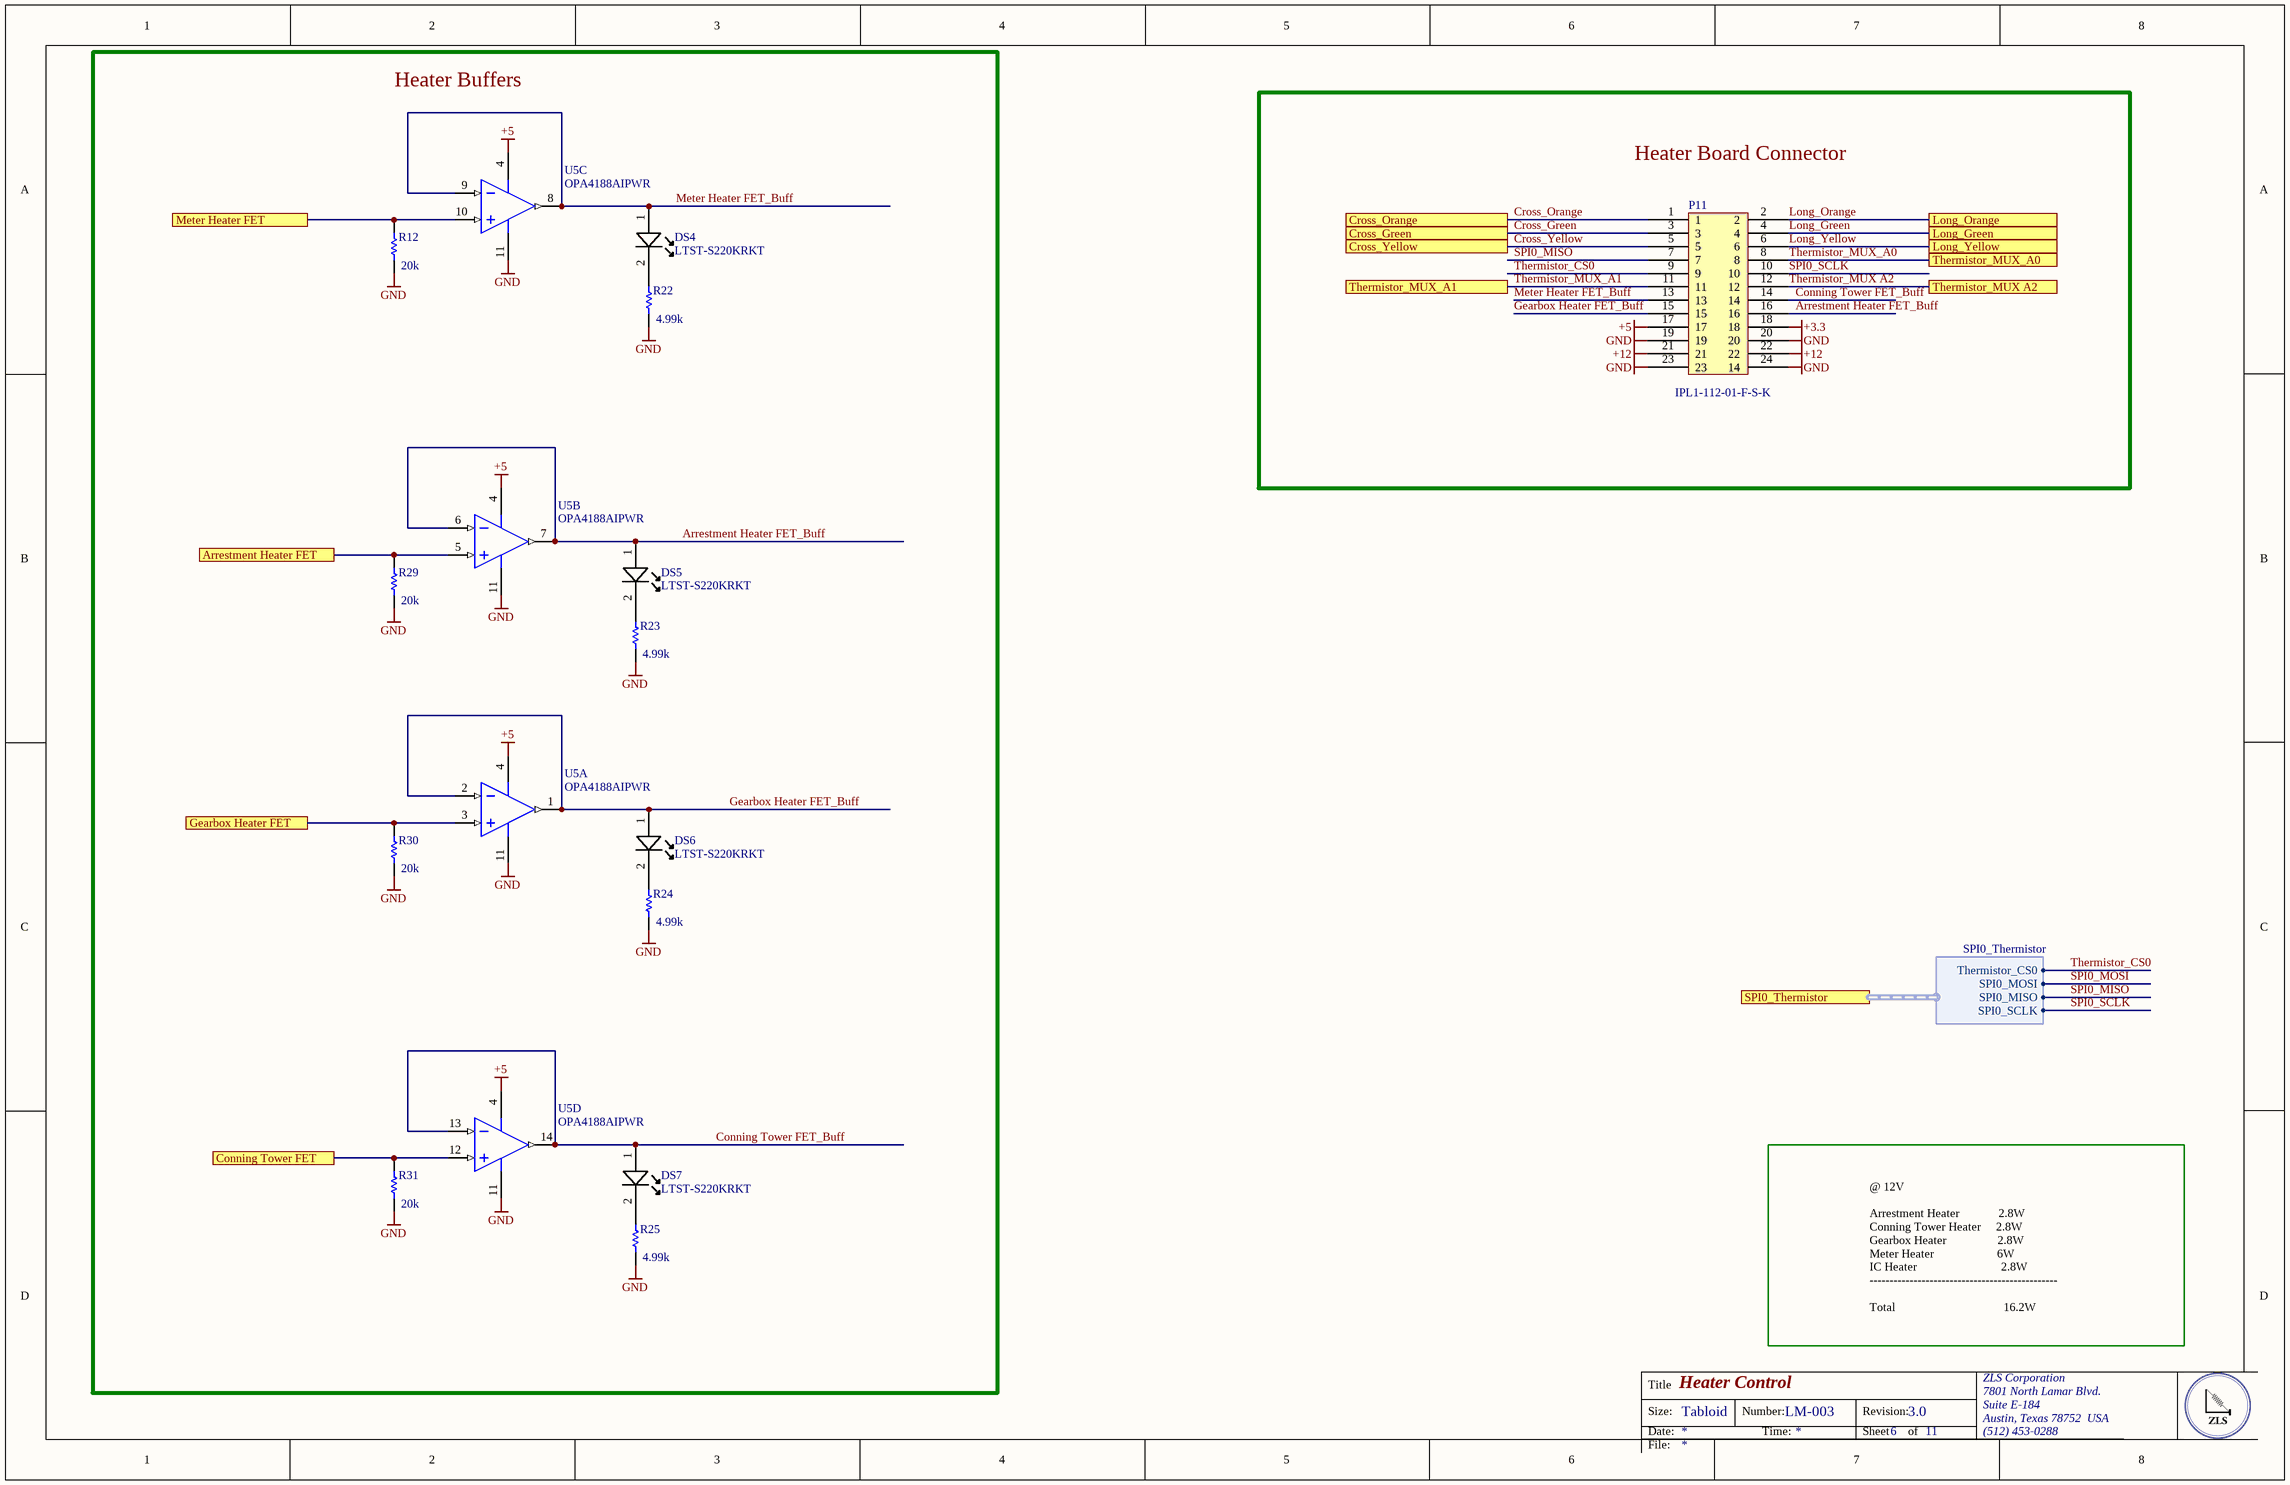
[diagram p4: heater_control.SchDoc]

### Parts
(Parts that share a designator on the sheet are numbered #1, #2 ... from top to bottom, then left to right.)
DS4  Manufacturer Part Number: LTST-S220KRKT  [0805C_L]  (hidden comment: Visible Name Value Type    False Description Lite-On LTST-S220KRKT Red LED, 631 nm 2012 (0805) Side View, Rectangle Lens SMD package STRING)
DS5  Manufacturer Part Number: LTST-S220KRKT  [0805C_L]  (hidden comment: Visible Name Value Type    False Description Lite-On LTST-S220KRKT Red LED, 631 nm 2012 (0805) Side View, Rectangle Lens SMD package STRING)
DS6  Manufacturer Part Number: LTST-S220KRKT  [0805C_L]  (hidden comment: Visible Name Value Type    False Description Lite-On LTST-S220KRKT Red LED, 631 nm 2012 (0805) Side View, Rectangle Lens SMD package STRING)
DS7  Manufacturer Part Number: LTST-S220KRKT  [0805C_L]  (hidden comment: Visible Name Value Type    False Description Lite-On LTST-S220KRKT Red LED, 631 nm 2012 (0805) Side View, Rectangle Lens SMD package STRING)
P11  IPL1-112-01-F-S-K  [IPL1-112-01-F-S-K]
R12#2  20k  [RESC0402(1005)_M]
R22  4.99k  [RESC0402(1005)_M]
R23  4.99k  [RESC0402(1005)_M]
R24  4.99k  [RESC0402(1005)_M]
R25  4.99k  [RESC0402(1005)_M]
R29  20k  [RESC0402(1005)_M]
R30  20k  [RESC0402(1005)_M]
R31  20k  [RESC0402(1005)_M]
U5#2  OPA4188AIPWR  [PW0014A_N]  (parts B,C of 4)
U5#3  OPA4188AIPWR  [PW0014A_N]  (parts A,D of 4)

### Blocks framed on the sheet
Heater Buffers: DS4-DS7 R12#2 R22-R25 R29-R31 U5#2 U5#3
Heater Board Connector: P11

### Ports
Arrestment Heater FET, Conning Tower FET, Cross_Green, Cross_Orange, Cross_Yellow, Gearbox Heater FET, Long_Green, Long_Orange, Long_Yellow, Meter Heater FET, SPI0_Thermistor (harness SPI0_Thermistor), Thermistor_MUX A2, Thermistor_MUX_A0, Thermistor_MUX_A1

### Harnesses
SPI0_Thermistor: Thermistor_CS0, SPI0_MOSI, SPI0_MISO, SPI0_SCLK

### Nets
+3.3: P11.18
+5: P11.17 U5#2.4(V+) U5#3.4(V+)
+12: P11.21 P11.22
GND: P11.19 P11.20 P11.23 P11.24(14) R12#2.2 R22.2 R23.2 R24.2 R25.2 R29.2 R30.2 R31.2 U5#2.11(V-) U5#3.11(V-)
Arrestment Heater FET: R29.1 U5#2.5(IN_B+) ; port Arrestment Heater FET
Arrestment Heater FET_Buff: DS5.1(A) P11.16 U5#2.6(IN_B-) U5#2.7(OUT_B)
Conning Tower FET: R31.1 U5#3.12(IN_D+) ; port Conning Tower FET
Conning Tower FET_Buff: DS7.1(A) P11.14 U5#3.13(IN_D-) U5#3.14(OUT_D)
Cross_Green: P11.3 ; port Cross_Green
Cross_Orange: P11.1 ; port Cross_Orange
Cross_Yellow: P11.5 ; port Cross_Yellow
Gearbox Heater FET: R30.1 U5#3.3(IN_A+) ; port Gearbox Heater FET
Gearbox Heater FET_Buff: DS6.1(A) P11.15 U5#3.1(OUT_A) U5#3.2(IN_A-)
Long_Green: P11.4 ; port Long_Green
Long_Orange: P11.2 ; port Long_Orange
Long_Yellow: P11.6 ; port Long_Yellow
Meter Heater FET: R12#2.1 U5#2.10(IN_C+) ; port Meter Heater FET
Meter Heater FET_Buff: DS4.1(A) P11.13 U5#2.8(OUT_C) U5#2.9(IN_C-)
SPI0_MISO: P11.7 ; port SPI0_Thermistor.SPI0_MISO
SPI0_SCLK: P11.10 ; port SPI0_Thermistor.SPI0_SCLK
Thermistor_CS0: P11.9 ; port SPI0_Thermistor.Thermistor_CS0
Thermistor_MUX A2: P11.12 ; port Thermistor_MUX A2
Thermistor_MUX_A0: P11.8 ; port Thermistor_MUX_A0
Thermistor_MUX_A1: P11.11 ; port Thermistor_MUX_A1
NetDS4_2: DS4.2(K) R22.1
NetDS5_2: DS5.2(K) R23.1
NetDS6_2: DS6.2(K) R24.1
NetDS7_2: DS7.2(K) R25.1

### Notes on the sheet
- @ 12V
  Arrestment Heater             2.8W
  Conning Tower Heater     2.8W
  Gearbox Heater                 2.8W
  Meter Heater                     6W
  IC Heater                            2.8W
  -----------------------------------------------
  Total                                    16.2W
- Title
- Size:
- Date:
- Tabloid
- Number:
- Time:
- Revision:
- Sheet
- of
- ZLS Corporation
- 7801 North Lamar Blvd.
- Suite E-184
- Austin, Texas 78752  USA
- (512) 453-0288
- File:

### Library data of the parts
DS4-DS7 = LED A/K: Manufacturer: Vishay / Lite-On; Lens Colour: Colorless; Lens Style: Diffused,Colorless; Viewing Angle: 130°; Luminous Intensity: 54mcd; Forward Current: 20mA; Forward Voltage: 2V; Power Rating: 75mW; Dominant Wavelength: 631nm; Lens Transparency: Clear; Number of Elements: 1; Wavelength: 639nm; Supplier 1: Digi-Key; Supplier Part Number 1: 160-1469-1-ND; Stock 1: 108191; Pricing 1: 1=0.31, 10=0.225, 25=0.1656, 100=0.1183, 250=0.0804, 500=0.071, 1000=0.0556 (USD); Mount: Surface Mount; Case/Package: 0805; Number of Pins: 2; Colour: Red; Case Code (Metric): 2012; Case Code (Imperial): 0805; Min Operating Temperature: -55°C; Max Operating Temperature: 85°C; Packaging: Tape and Reel; Package Quantity: 4000; Illumination Colour: Red; Test Current: 20mA; Power Dissipation: 75mW; Number of LEDs: 1; Length: 2.1mm; Height: 0.6mm; Width: 1mm; Depth: 0.6mm; Radiation Hardening: No; Lead Free: Lead Free; ComponentLink1URL: https://datasheet.ciiva.com/2110/s-110-ltst-s220krkt-2110132.pdf; ComponentLink1Description: https://datasheet.ciiva.com/2110/s-110-ltst-s220krkt-2110132.pdf; ComponentLink2URL: https://datasheet.ciiva.com/2110/s-110-ltst-s220krkt-2110133.pdf; ComponentLink2Description: https://datasheet.ciiva.com/2110/s-110-ltst-s220krkt-2110133.pdf; ComponentLink3URL: https://datasheet.ciiva.com/2110/s-110-ltst-s220krkt-2110134.pdf; ComponentLink3Description: https://datasheet.ciiva.com/2110/s-110-ltst-s220krkt-2110134.pdf; ComponentLink4URL: https://datasheet.ciiva.com/12403/lite-on-ltst-s220krkt-187389-12403798.pdf; ComponentLink4Description: https://datasheet.ciiva.com/12403/lite-on-ltst-s220krkt-187389-12403798.pdf; ComponentLink5URL: https://datasheet.ciiva.com/16345/lite-onltst-s220krkt-16345511.pdf; ComponentLink5Description: https://datasheet.ciiva.com/16345/lite-onltst-s220krkt-16345511.pdf; ComponentLink6URL: https://datasheet.ciiva.com/15118/getdatasheetpartid-225752-15118120.pdf; ComponentLink6Description: https://datasheet.ciiva.com/15118/getdatasheetpartid-225752-15118120.pdf; ComponentLink7URL: https://datasheet.ciiva.com/14633/0900766b80dc0b76-14633737.pdf; ComponentLink7Description: https://datasheet.ciiva.com/14633/0900766b80dc0b76-14633737.pdf; ComponentLink8URL: https://datasheet.ciiva.com/11775/0900766b80dc0b76-11775439.pdf; ComponentLink8Description: https://datasheet.ciiva.com/11775/0900766b80dc0b76-11775439.pdf
P11 = IPL1-112-01-F-S-K: IPL1-112-01-F-D-K; Manufacturer: Samtec; Number of Contacts: 12; Gender: Male; Pitch: 2.54mm; Supplier 1: Newark; Supplier Part Number 1: 08W3504; Supplier 2: Avnet; Supplier Part Number 2: IPL1-112-01-F-S-K; Manufacturer Part Number: IPL1-112-01-F-S-K; Stock 2: 0; Mount: Through Hole; Packaging: Bulk; Termination: Solder; Orientation: Straight; Radiation Hardening: No; ComponentLink1URL: https://datasheet.ciiva.com/9444/ipl1-9444389.pdf; ComponentLink1Description: https://datasheet.ciiva.com/9444/ipl1-9444389.pdf
R12#2 R22-R25 R29-R31 = CMP-1011-00651-1
U5#2 U5#3 = CMP-0809-00009-2: 0.03 uV/C, Low Noise, Rail-to-Rail Output, Zero-Drift Operational Amplifier, 4 to 36 V, -40 to 125 degC, 14-pin SOP (PW14), Green (RoHS & no Sb/Br); Manufacturer: Texas Instruments; Number of Channels: 4; Iq per channel(Max)(mA): 0.475; CMRR(Min)(dB): 120; GBW(Typ)(MHz): 2; Offset Drift(Typ)(uV/C): 0.03; Total Supply Voltage(Max)(+5V is 5, +/-5V is 10): 36; Rating: Catalog; Slew Rate(Typ)(V/us): 0.8; SubFamily: High Supply Voltage Amplifier (>=30V), Low Noise Amp (<=10nV/rtHz), Low Offset Voltage Amplifier (<=500uV), Low Power Amp (<=500uA), Zero Drift Precision Amplifier; ComponentLink2URL: http://www.ti.com/lit/ds/symlink/opa4188.pdf; PackageReference: PW0014A; ComponentLink3URL: http://www.ti.com/litv/pdf/mpds360; Eco-Plan: Green (RoHS & no Sb/Br); PackageVersion: 4040064-3/G, 02/2011; PartNumber: OPA4188AIPWR; ComponentLink2Description: Datasheet; DatasheetVersion: SBOS641B; Code_JEDEC: MO-153; Mounting Technology: Surface Mount; Total Supply Voltage(Min)(+5V is 5, +/-5V is 10): 4; ComponentLink1URL: http://www.ti.com/; ComponentLink3Description: Package Specification; PackageDescription: 14-Pin Plastic Small Outline, Body 5 x 4.4 mm, Pitch 0.65 mm; ComponentLink1Description: Manufacturer URL; PartId: 1

## Nets that join several sheets
+3.3: Power (5 pins), BBB Headers (6 pins), Connectors (P6.5 P9#1.5), RS232 (DS3.4 P9#2.J2-3 P9#2.J2-4), heater_control (P11.18)
+5: Power (10 pins), Connectors (5 pins), heater_control (P11.17 U5#2.4 U5#3.4)
+5 BBB: Power (R8.2), BBB Headers (U5#1.9-5 U5#1.9-6), Connectors (P8.2)
+12: Power (R2.2), Connectors (P7.6 P8.15 P8.16), heater_control (P11.21 P11.22)
-5: Power (R12#1.1), Connectors (P7.8 P9#1.15)
GND: Power (19 pins), BBB Headers (14 pins), Connectors (17 pins), RS232 (P9#2.J2-1 P9#2.J2-2 P10.1), heater_control (14 pins)
Power_IN: Power (R3.2 R13.2), Connectors (P9#1.2)
Arrestment Heater FET: BBB Headers (U5#1.8-3), heater_control (R29.1 U5#2.5)
Conning Tower FET: BBB Headers (U5#1.8-4), heater_control (R31.1 U5#3.12)
Cross_Green: Connectors (P2.2), heater_control (P11.3)
Cross_Orange: Connectors (P2.3), heater_control (P11.1)
Cross_Yellow: Connectors (P2.1), heater_control (P11.5)
CS_Power_Supplies: Power (U2.9), BBB Headers (U7.7)
FB_CS0: BBB Headers (U7.4), Connectors (P6.9)
FB_MUX_A0: BBB Headers (U5#1.8-25), Connectors (P6.6)
FB_MUX_A1: BBB Headers (U5#1.8-26), Connectors (P6.4)
Gearbox Heater FET: BBB Headers (U5#1.8-6), heater_control (R30.1 U5#3.3)
Long_Green: Connectors (P4.2), heater_control (P11.4)
Long_Orange: Connectors (P4.3), heater_control (P11.2)
Long_Yellow: Connectors (P4.1), heater_control (P11.6)
Meter Heater FET: BBB Headers (U5#1.8-5), heater_control (R12#2.1 U5#2.10)
MUX D2: Power (U1.15), BBB Headers (U5#1.8-16)
MUX_D0: Power (U1.1), BBB Headers (U5#1.8-14)
MUX_D1: Power (U1.16), BBB Headers (U5#1.8-15)
NetP7_4: BBB Headers (U5#1.8-23), Connectors (P7.4)
NetP8_4: BBB Headers (U5#1.9-9), Connectors (P8.4)
PWM1A: BBB Headers (U5#1.9-14), Connectors (P6.1)
PWM2B: BBB Headers (U5#1.8-13), Connectors (P7.7)
Relay_Out: Power (DS2.1), Connectors (P9#1.4)
Serial1_RX: BBB Headers (R15.2 U5#1.9-26 U6.1 U6.4), Connectors (P5.3)
Serial1_TX: BBB Headers (R15.1 R16.2 U5#1.9-24), Connectors (P5.2)
Serial4_RX: BBB Headers (U5#1.9-11), RS232 (R21.2)
Serial4_TX: BBB Headers (U5#1.9-13), RS232 (R20.2)
SPI0_MISO: Power (U2.1), BBB Headers (P1.6 U5#1.9-21), Connectors (P6.8), heater_control (P11.7)
SPI0_SCLK: Power (U2.10), BBB Headers (P1.4 U5#1.9-22), Connectors (P6.10), heater_control (P11.10)
SPI1_CS0: BBB Headers (U5#1.9-28), Connectors (P3.7)
SPI1_MISO: BBB Headers (U5#1.9-29), Connectors (P3.4)
SPI1_MOSI: BBB Headers (U5#1.9-30), Connectors (P3.5)
SPI1_SCLK: BBB Headers (U5#1.9-31), Connectors (P3.6)
Sys_Pwr_Enable: BBB Headers (U5#1.8-22), Connectors (P8.8)
Thermistor_CS0: BBB Headers (U7.5), heater_control (P11.9)
Thermistor_MUX A2: BBB Headers (U5#1.8-33), heater_control (P11.12)
Thermistor_MUX_A0: BBB Headers (U5#1.8-31), heater_control (P11.8)
Thermistor_MUX_A1: BBB Headers (U5#1.8-32), heater_control (P11.11)